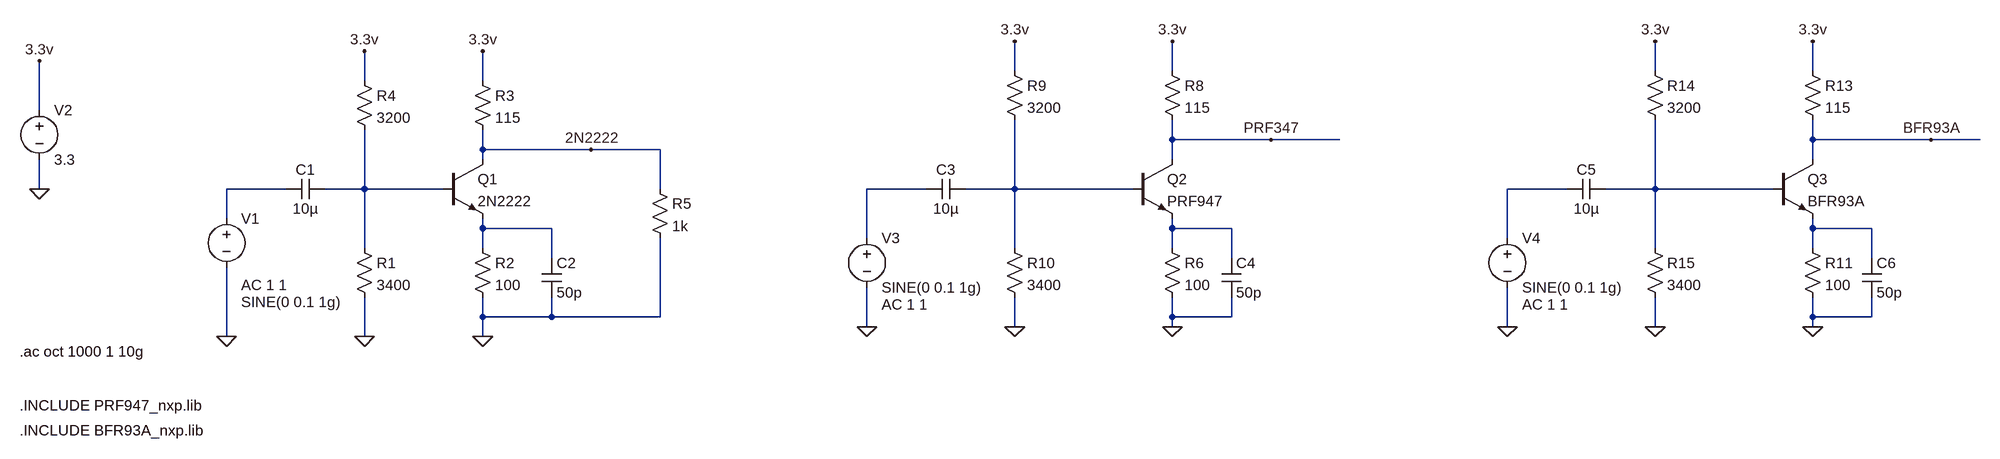
[diagram p0: schematic test_amp.asc]
test_amp.asc, the LTspice schematic file:
Version 4
SHEET 1 2744 680
WIRE 1104 -16 1104 -64
WIRE 1360 -16 1360 -64
WIRE 2144 -16 2144 -64
WIRE 2400 -16 2400 -64
WIRE 48 0 48 -48
WIRE 240 0 240 -48
WIRE -480 48 -480 -32
WIRE 1360 96 1360 64
WIRE 1520 96 1360 96
WIRE 1632 96 1520 96
WIRE 2400 96 2400 64
WIRE 2592 96 2400 96
WIRE 2672 96 2592 96
WIRE 240 112 240 80
WIRE 416 112 240 112
WIRE 528 112 416 112
WIRE 240 128 240 112
WIRE 1360 128 1360 96
WIRE 2400 128 2400 96
WIRE -480 176 -480 128
WIRE -80 176 -176 176
WIRE 48 176 48 80
WIRE 48 176 -16 176
WIRE 176 176 48 176
WIRE 528 176 528 112
WIRE 960 176 864 176
WIRE 1104 176 1104 64
WIRE 1104 176 1024 176
WIRE 1296 176 1104 176
WIRE 2000 176 1904 176
WIRE 2144 176 2144 64
WIRE 2144 176 2064 176
WIRE 2336 176 2144 176
WIRE -176 224 -176 176
WIRE 240 240 240 224
WIRE 352 240 240 240
WIRE 1360 240 1360 224
WIRE 1456 240 1360 240
WIRE 2400 240 2400 224
WIRE 2496 240 2400 240
WIRE 864 256 864 176
WIRE 1904 256 1904 176
WIRE 48 272 48 176
WIRE 240 272 240 240
WIRE 1104 272 1104 176
WIRE 1360 272 1360 240
WIRE 2144 272 2144 176
WIRE 2400 272 2400 240
WIRE 352 288 352 240
WIRE 1456 288 1456 240
WIRE 2496 288 2496 240
WIRE 240 384 240 352
WIRE 352 384 352 352
WIRE 352 384 240 384
WIRE 528 384 528 256
WIRE 528 384 352 384
WIRE 1360 384 1360 352
WIRE 1456 384 1456 352
WIRE 1456 384 1360 384
WIRE 2400 384 2400 352
WIRE 2496 384 2496 352
WIRE 2496 384 2400 384
WIRE 864 400 864 336
WIRE 1104 400 1104 352
WIRE 1360 400 1360 384
WIRE 1904 400 1904 336
WIRE 2144 400 2144 352
WIRE 2400 400 2400 384
WIRE -176 416 -176 304
WIRE 48 416 48 352
WIRE 240 416 240 384
FLAG -176 416 0
FLAG 48 416 0
FLAG 240 416 0
FLAG -480 176 0
FLAG -480 -32 3.3v
FLAG 48 -48 3.3v
FLAG 240 -48 3.3v
FLAG 1360 400 0
FLAG 1104 400 0
FLAG 864 400 0
FLAG 1104 -64 3.3v
FLAG 1360 -64 3.3v
FLAG 2400 400 0
FLAG 2144 400 0
FLAG 1904 400 0
FLAG 2144 -64 3.3v
FLAG 2400 -64 3.3v
FLAG 2592 96 BFR93A
FLAG 1520 96 PRF347
FLAG 416 112 2N2222
SYMBOL npn 176 128 R0
SYMATTR InstName Q1
SYMATTR Value 2N2222
SYMBOL res 32 256 R0
SYMATTR InstName R1
SYMATTR Value 3400
SYMBOL res 224 256 R0
SYMATTR InstName R2
SYMATTR Value 100
SYMBOL res 224 -16 R0
SYMATTR InstName R3
SYMATTR Value 115
SYMBOL res 32 -16 R0
SYMATTR InstName R4
SYMATTR Value 3200
SYMBOL cap -16 160 R90
WINDOW 0 0 32 VBottom 2
WINDOW 3 32 32 VTop 2
SYMATTR InstName C1
SYMATTR Value 10µ
SYMBOL voltage -176 208 R0
WINDOW 3 24 152 Left 2
WINDOW 123 24 124 Left 2
WINDOW 39 0 0 Left 2
SYMATTR Value SINE(0 0.1 1g)
SYMATTR Value2 AC 1 1
SYMATTR InstName V1
SYMBOL voltage -480 32 R0
WINDOW 123 0 0 Left 2
WINDOW 39 0 0 Left 2
SYMATTR InstName V2
SYMATTR Value 3.3
SYMBOL cap 336 288 R0
SYMATTR InstName C2
SYMATTR Value 50p
SYMBOL res 512 160 R0
SYMATTR InstName R5
SYMATTR Value 1k
SYMBOL npn 1296 128 R0
SYMATTR InstName Q2
SYMATTR Value PRF947
SYMATTR Prefix X
SYMBOL res 1344 256 R0
SYMATTR InstName R6
SYMATTR Value 100
SYMBOL res 1344 -32 R0
SYMATTR InstName R8
SYMATTR Value 115
SYMBOL res 1088 -32 R0
SYMATTR InstName R9
SYMATTR Value 3200
SYMBOL res 1088 256 R0
SYMATTR InstName R10
SYMATTR Value 3400
SYMBOL cap 1024 160 R90
WINDOW 0 0 32 VBottom 2
WINDOW 3 32 32 VTop 2
SYMATTR InstName C3
SYMATTR Value 10µ
SYMBOL voltage 864 240 R0
WINDOW 123 24 124 Left 2
WINDOW 39 0 0 Left 2
SYMATTR Value2 AC 1 1
SYMATTR InstName V3
SYMATTR Value SINE(0 0.1 1g)
SYMBOL cap 1440 288 R0
SYMATTR InstName C4
SYMATTR Value 50p
SYMBOL npn 2336 128 R0
SYMATTR InstName Q3
SYMATTR Value BFR93A
SYMATTR Prefix X
SYMBOL res 2384 256 R0
SYMATTR InstName R11
SYMATTR Value 100
SYMBOL res 2384 -32 R0
SYMATTR InstName R13
SYMATTR Value 115
SYMBOL res 2128 -32 R0
SYMATTR InstName R14
SYMATTR Value 3200
SYMBOL res 2128 256 R0
SYMATTR InstName R15
SYMATTR Value 3400
SYMBOL cap 2064 160 R90
WINDOW 0 0 32 VBottom 2
WINDOW 3 32 32 VTop 2
SYMATTR InstName C5
SYMATTR Value 10µ
SYMBOL voltage 1904 240 R0
WINDOW 123 24 124 Left 2
WINDOW 39 0 0 Left 2
SYMATTR Value2 AC 1 1
SYMATTR InstName V4
SYMATTR Value SINE(0 0.1 1g)
SYMBOL cap 2480 288 R0
SYMATTR InstName C6
SYMATTR Value 50p
TEXT -512 440 Left 2 !.ac oct 1000 1 10g
TEXT -512 528 Left 2 !.INCLUDE PRF947_nxp.lib
TEXT -512 568 Left 2 !.INCLUDE BFR93A_nxp.lib

The netlist it stands for:
* test_amp.asc
Q1 2N2222 N002 N007 0 2N2222
R1 N002 0 3400
R2 N007 0 100
R3 3.3v 2N2222 115
R4 3.3v N002 3200
C1 N002 N001 10µ
V1 N001 0 SINE(0 0.1 1g) AC 1 1
V2 3.3v 0 3.3
C2 N007 0 50p
R5 2N2222 0 1k
XQ2 PRF347 N004 N008 PRF947  ; pins C B E
R6 N008 0 100
R8 3.3v PRF347 115
R9 3.3v N004 3200
R10 N004 0 3400
C3 N004 N003 10µ
V3 N003 0 SINE(0 0.1 1g) AC 1 1
C4 N008 0 50p
XQ3 BFR93A N006 N009 BFR93A  ; pins C B E
R11 N009 0 100
R13 3.3v BFR93A 115
R14 3.3v N006 3200
R15 N006 0 3400
C5 N006 N005 10µ
V4 N005 0 SINE(0 0.1 1g) AC 1 1
C6 N009 0 50p
.model NPN NPN
.model PNP PNP
.lib standard.bjt
.ac oct 1000 1 10g
.INCLUDE PRF947_nxp.lib
.INCLUDE BFR93A_nxp.lib
.backanno
.end